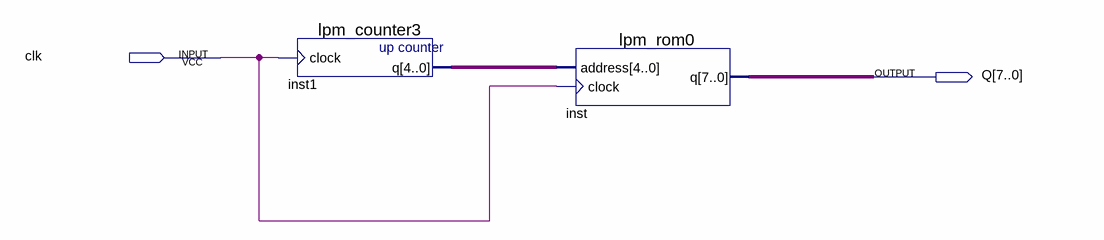
[diagram p0: schematic sheet]
// Quartus schematic mtROM.bdf as structural Verilog: 2 symbols, 2 pins
module mtROM (
  input  clk,
  output [7:0] Q
);

  wire [4:0] inst1_q;

  lpm_counter3 inst1 (.clock(clk), .q(inst1_q));
  lpm_rom0 inst (.address(inst1_q), .clock(clk), .q(Q));
endmodule
